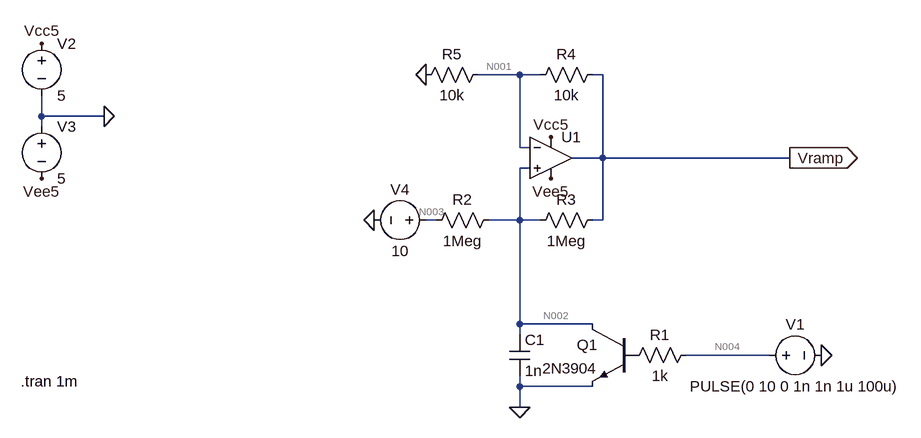
[diagram p0: schematic Draft 1 - Starting.asc]
Draft 1 - Starting.asc, the LTspice schematic file:
Version 4.1
SHEET 1 1196 680
WIRE 368 -240 304 -240
WIRE 400 -240 368 -240
WIRE 496 -240 480 -240
WIRE -368 -176 -368 -208
WIRE -272 -176 -368 -176
WIRE -368 -160 -368 -176
WIRE 368 -128 368 -240
WIRE 384 -128 368 -128
WIRE 496 -112 496 -240
WIRE 496 -112 448 -112
WIRE 784 -112 496 -112
WIRE 384 -96 368 -96
WIRE 240 -16 224 -16
WIRE 368 -16 368 -96
WIRE 368 -16 320 -16
WIRE 400 -16 368 -16
WIRE 496 -16 496 -112
WIRE 496 -16 480 -16
WIRE 368 144 368 -16
WIRE 480 144 368 144
WIRE 368 160 368 144
WIRE 752 192 624 192
WIRE 368 240 368 224
WIRE 480 240 368 240
WIRE 368 272 368 240
FLAG -272 -176 0
FLAG -368 -80 Vee5
FLAG -368 -288 Vcc5
FLAG 832 192 0
FLAG 368 272 0
FLAG 144 -16 0
FLAG 224 -240 0
FLAG 784 -112 Vramp
IOPIN 784 -112 Out
FLAG 416 -144 Vcc5
FLAG 416 -80 Vee5
SYMBOL voltage -368 -304 R0
SYMATTR InstName V2
SYMATTR Value 5
SYMBOL voltage -368 -176 R0
SYMATTR InstName V3
SYMATTR Value 5
SYMBOL npn 544 144 M0
SYMATTR InstName Q1
SYMATTR Value 2N3904
SYMBOL res 640 176 R90
WINDOW 0 0 56 VBottom 2
WINDOW 3 32 56 VTop 2
SYMATTR InstName R1
SYMATTR Value 1k
SYMBOL voltage 736 192 R270
WINDOW 0 32 56 VTop 2
WINDOW 3 -32 56 VBottom 2
WINDOW 123 0 0 Left 0
WINDOW 39 0 0 Left 0
SYMATTR InstName V1
SYMATTR Value PULSE(0 10 0 1n 1n 1u 100u)
SYMBOL cap 352 160 R0
SYMATTR InstName C1
SYMATTR Value 1n
SYMBOL OpAmps\\UniversalOpAmp2 416 -112 R0
SYMATTR InstName U1
SYMBOL res 336 -32 R90
WINDOW 0 0 56 VBottom 2
WINDOW 3 32 56 VTop 2
SYMATTR InstName R2
SYMATTR Value 1Meg
SYMBOL voltage 240 -16 R90
WINDOW 0 -32 56 VBottom 2
WINDOW 3 32 56 VTop 2
SYMATTR InstName V4
SYMATTR Value 10
SYMBOL res 496 -32 R90
WINDOW 0 0 56 VBottom 2
WINDOW 3 32 56 VTop 2
SYMATTR InstName R3
SYMATTR Value 1Meg
SYMBOL res 496 -256 R90
WINDOW 0 0 56 VBottom 2
WINDOW 3 32 56 VTop 2
SYMATTR InstName R4
SYMATTR Value 10k
SYMBOL res 320 -256 R90
WINDOW 0 0 56 VBottom 2
WINDOW 3 32 56 VTop 2
SYMATTR InstName R5
SYMATTR Value 10k
TEXT -400 232 Left 2 !.tran 1m

The netlist it stands for:
* Draft 1 - Starting.asc
V2 Vcc5 0 5
V3 0 Vee5 5
Q1 N002 P001 0 0 2N3904
R1 N004 P001 1k
V1 N004 0 PULSE(0 10 0 1n 1n 1u 100u)
C1 N002 0 1n
X§U1 N002 N001 Vcc5 Vee5 Vramp level2 Avol=1Meg GBW=10Meg Slew=10Meg Ilimit=25m Rail=0 Vos=0 En=0 Enk=0 In=0 Ink=0 Rin=500Meg  ; pins In+ In- V+ V- OUT
R2 N002 N003 1Meg
V4 N003 0 10
R3 Vramp N002 1Meg
R4 Vramp N001 10k
R5 N001 0 10k
.model NPN NPN
.model PNP PNP
.lib standard.bjt
.tran 1m
.lib UniversalOpAmp2.lib
.backanno
.end

* Results of the author's LTspice run, read from the files saved beside the schematic
* Operating Point, zero values left out:
*   V(vee5) = -5 V
*   V(vramp) = 4.997 V
*   V(vcc5) = 5 V
*   V(n002) = 7.491 V
*   V(n001) = 2.499 V
*   V(n003) = 10 V
*   Ic(Q1) = 7.505 pA
*   Ib(Q1) = -7.494 pA
*   I(V1) = 7.494 pA
*   I(R3) = -2.494 µA
*   I(R5) = 249.9 µA
*   I(V2) = -248.4 µA
*   I(R2) = -2.509 µA
*   I(R4) = 249.9 µA
*   I(V3) = -1.168 µA
*   I(R1) = -7.494 pA
*   I(V4) = -2.509 µA
*   Ix(u1:1) = 14.98 nA
*   Ix(u1:2) = 4.997 nA
*   Ix(u1:3) = 248.4 µA
*   Ix(u1:4) = -1.168 µA
*   Ix(u1:5) = -247.4 µA
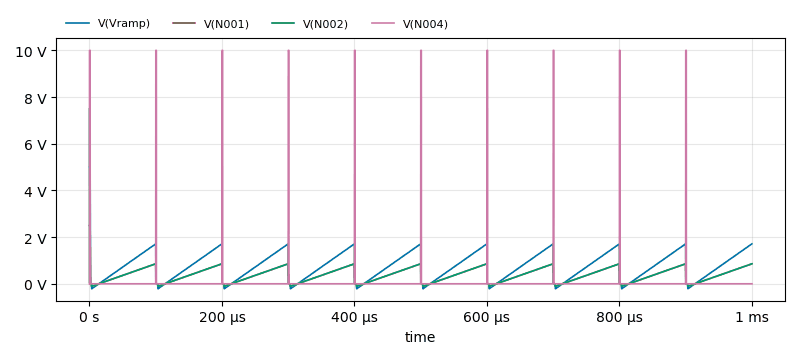
[diagram p1: Transient Analysis of Draft 1 - Starting.asc, plotted from the saved traces]
* Transient Analysis, 1 run:
*   V(Vramp): min -214.9 mV, max 4.997 V, average 729.1 mV, rms 932.1 mV, last 1.71 V
*   V(N001): min -107.5 mV, max 2.499 V, average 364.5 mV, rms 466 mV, last 854.9 mV
*   V(N002): min -108.2 mV, max 7.492 V, average 361.2 mV, rms 458.9 mV, last 855.3 mV
*   V(N004): min 0 V, max 10 V, average 100.1 mV, rms 1 V, last 0 V